# Altium schematic sheet Sheet2_Hierarquia.SchDoc
size A4; SheetNumber: 2; SheetTotal: 7
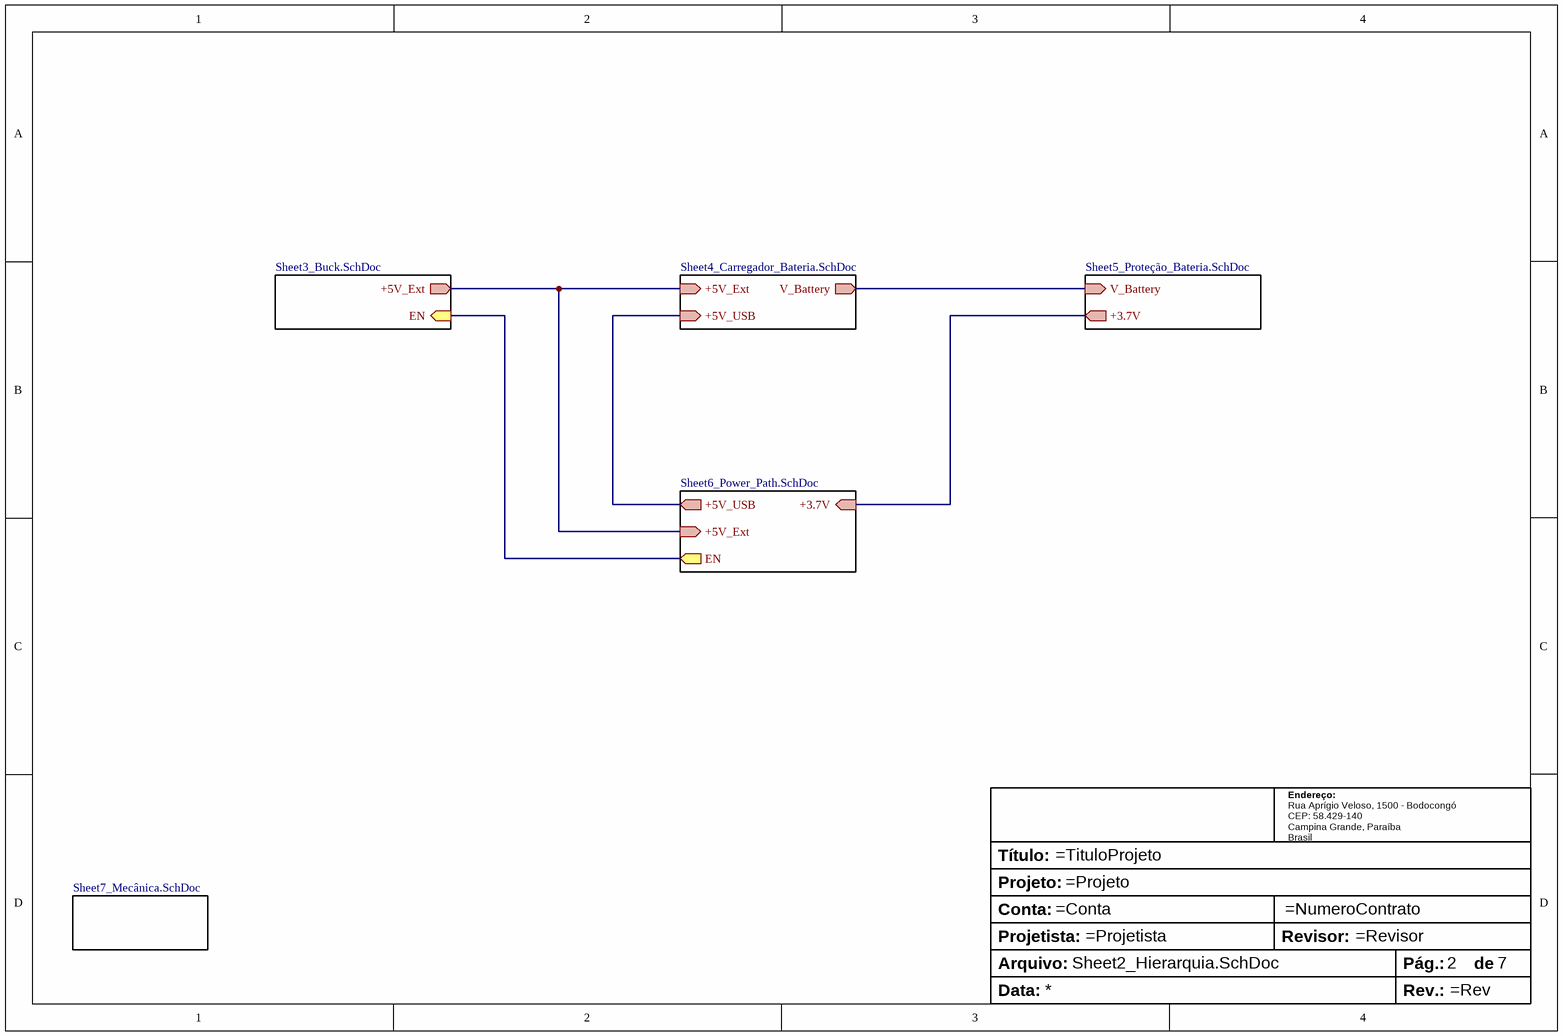
[diagram p0: Sheet2_Hierarquia.SchDoc]

## Parts
TB?  Title Block  (value not drawn)  (graphical)

## Sub-sheets
Buck = Sheet3_Buck.SchDoc: +5V_Ext (out), EN (in)
Carregador_Bateria = Sheet4_Carregador_Bateria.SchDoc: +5V_Ext (in), +5V_USB (in), V_Battery (out)
Mecânica = Sheet7_Mecânica.SchDoc: no entries
Power_Path = Sheet6_Power_Path.SchDoc: +5V_USB (out), +5V_Ext (in), EN (out), +3.7V (in)
Proteção_Bateria = Sheet5_Proteção_Bateria.SchDoc: V_Battery (in), +3.7V (out)

## Nets
(unnamed): sheet Buck/+5V_Ext, sheet Carregador_Bateria/+5V_Ext, sheet Power_Path/+5V_Ext
(unnamed): sheet Buck/EN, sheet Power_Path/EN
(unnamed): sheet Carregador_Bateria/+5V_USB, sheet Power_Path/+5V_USB
(unnamed): sheet Carregador_Bateria/V_Battery, sheet Proteção_Bateria/V_Battery
(unnamed): sheet Proteção_Bateria/+3.7V, sheet Power_Path/+3.7V

## Notes on the sheet
- (in symbol Title Block) Endereço:; Rua Aprígio Veloso, 1500 - Bodocongó / CEP: 58.429-140 / Campina Grande, Paraíba / Brasil; Título:; Projeto:; Conta:; Projetista:; Revisor:; Arquivo:; Pág.:; de; Data:; Rev.: